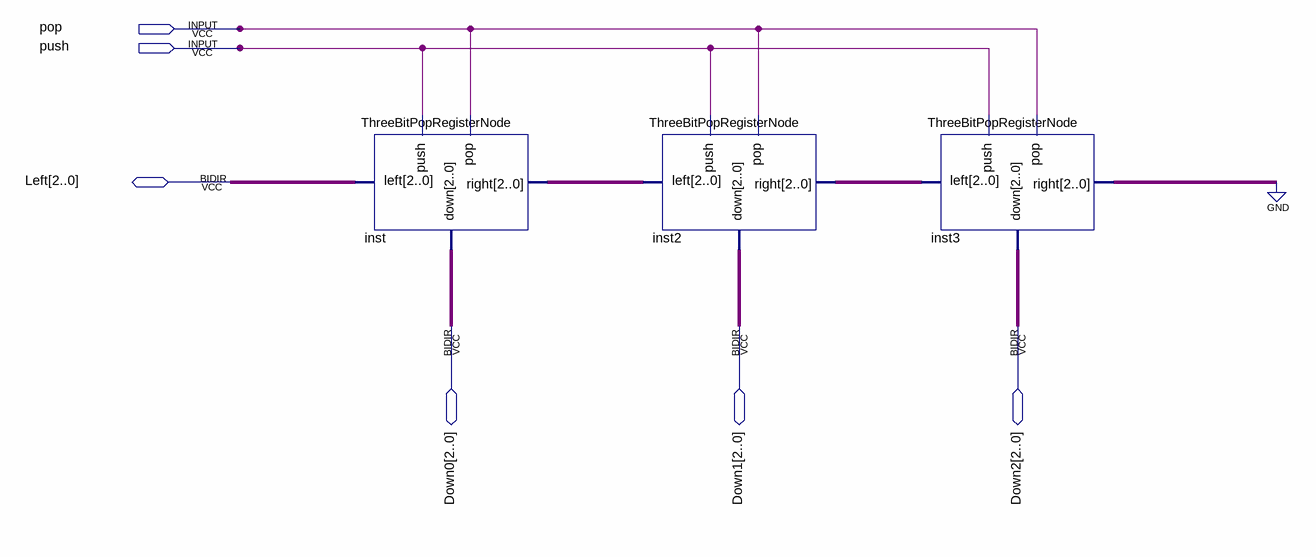
[diagram p0: schematic sheet]
// Quartus schematic threeBitby3popregister.bdf as structural Verilog: 3 symbols, 6 pins
module threeBitby3popregister (
  input  pop,
  input  push,
  inout  [2:0] Left,
  inout  [2:0] Down0,
  inout  [2:0] Down1,
  inout  [2:0] Down2
);

  wire [2:0] inst2_right, inst3_right, inst_right;

  ThreeBitPopRegisterNode inst (.push(push), .pop(pop), .left(Left), .right(inst_right), .down(Down0));
  ThreeBitPopRegisterNode inst2 (.push(push), .pop(pop), .left(inst_right), .right(inst2_right), .down(Down1));
  ThreeBitPopRegisterNode inst3 (.push(push), .pop(pop), .left(inst2_right), .right(inst3_right), .down(Down2));
  // also tied to GND on the sheet: {inst3_right[0], inst3_right[1], inst3_right[2]}
endmodule
